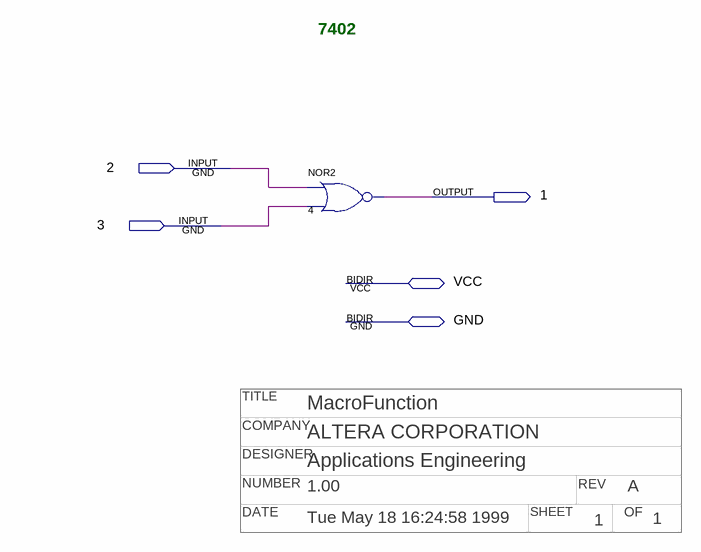
[diagram p0: schematic sheet]
// Quartus schematic np7402.bdf as structural Verilog: 1 symbols, 5 pins
// Title block: TITLE: MacroFunction; COMPANY: ALTERA CORPORATION; DESIGNER: Applications Engineering; NUMBER: 1.00; REV: A; DATE: Tue May 18 16:24:58 1999; SHEET: 1; OF: 1
module np7402 (
  input  \2 ,
  input  \3 ,
  inout  VCC,
  inout  GND,
  output \1 
);

  nor u_4 (\1 , \2 , \3 );

  // Notes on the sheet:
  //   7402
endmodule
